# EAGLE design USBISPTiny (EAGLE 6.1)
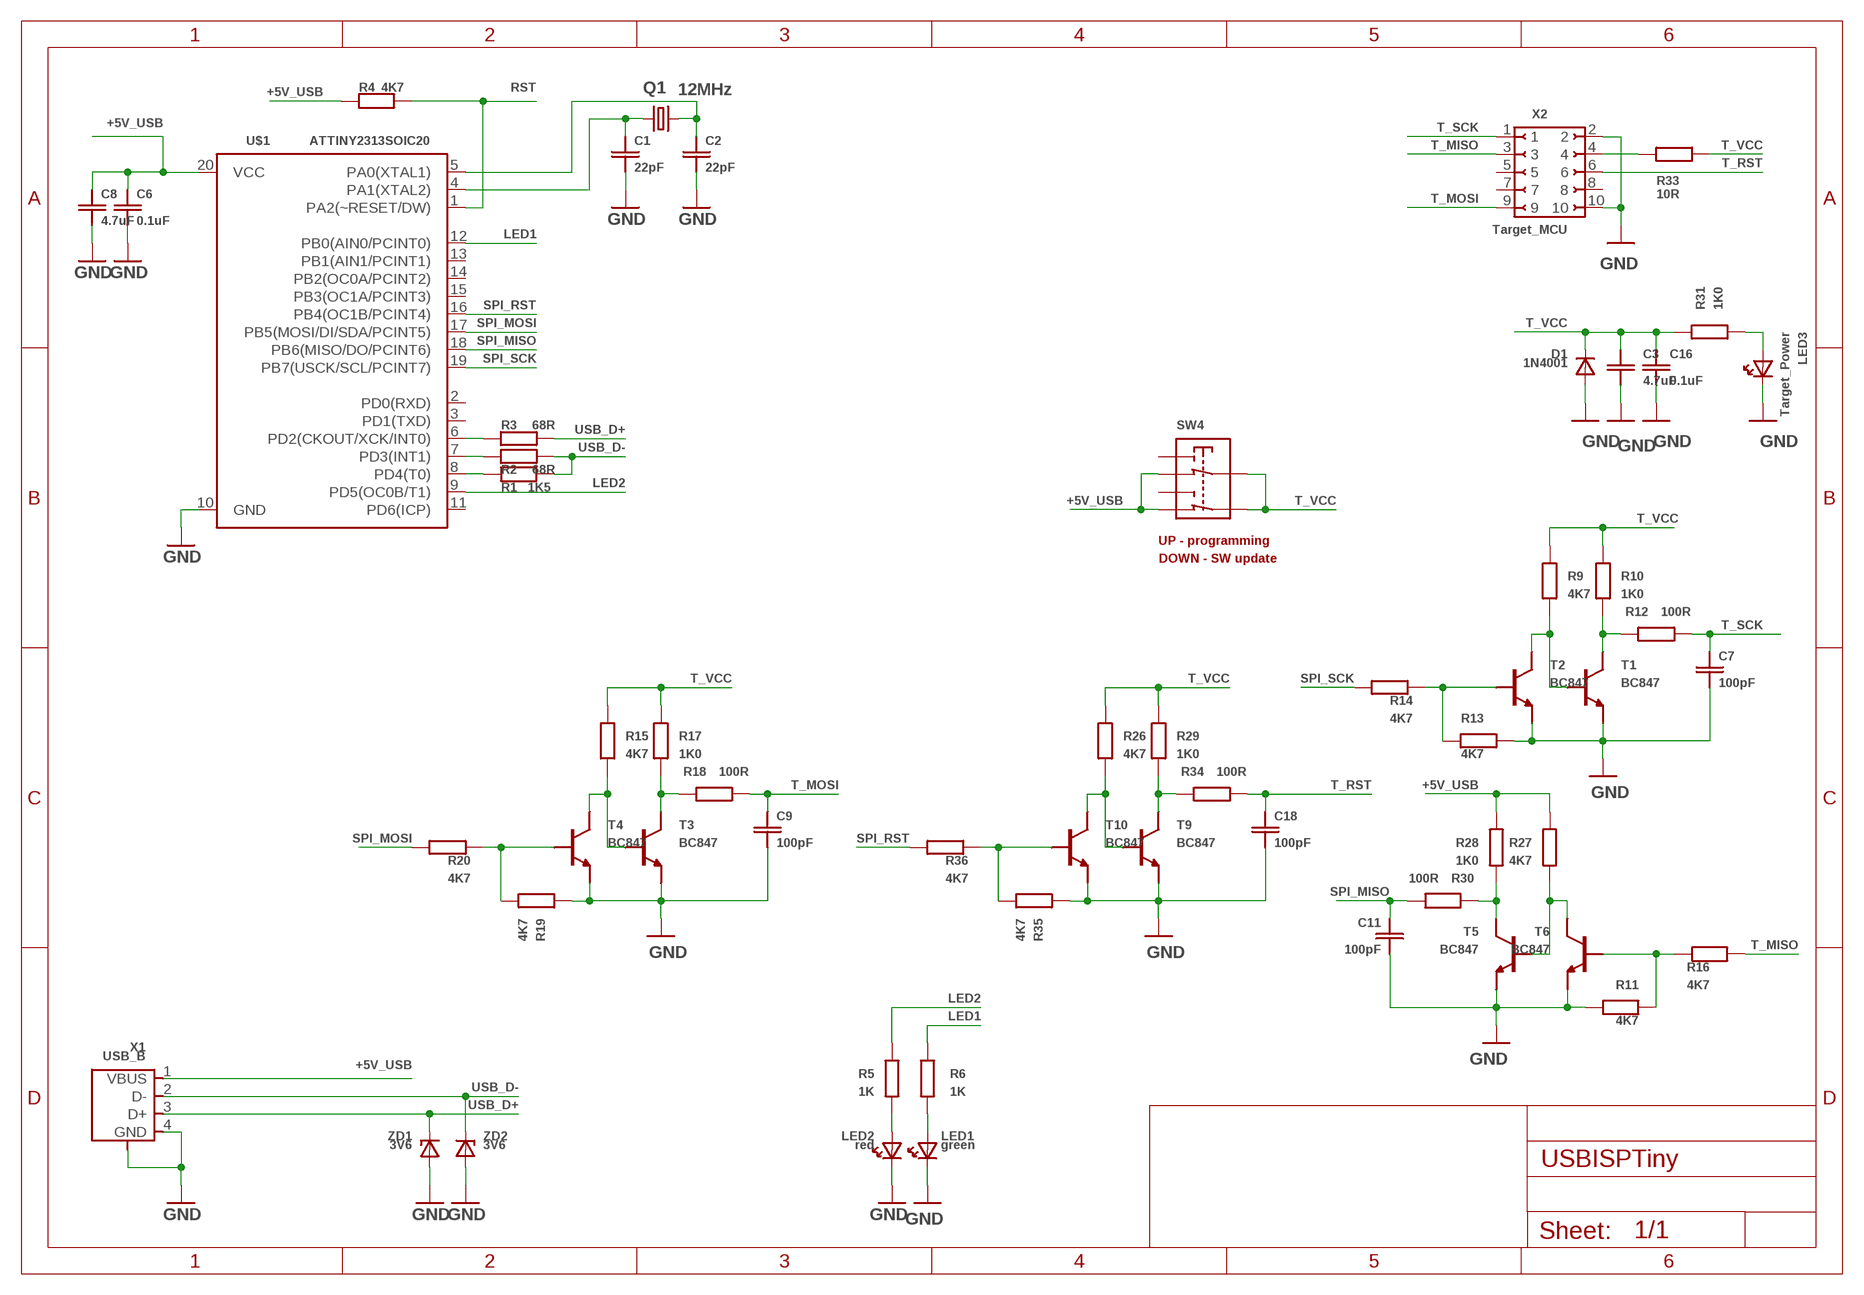
[diagram p0: schematic, sheet 1]

## Parts
C1  22pF  CSMD_0805  [RSMD_0805]
C2  22pF  CSMD_0805  [RSMD_0805]
C3  4.7uF  CSMD_1206  [RSMD_1206]
C6  0.1uF  CSMD_0805  [RSMD_0805]
C7  100pF  CSMD_0805  [RSMD_0805]
C8  4.7uF  CSMD_1206  [RSMD_1206]
C9  100pF  CSMD_0805  [RSMD_0805]
C11  100pF  CSMD_0805  [RSMD_0805]
C16  0.1uF  CSMD_0805  [RSMD_0805]
C18  100pF  CSMD_0805  [RSMD_0805]
D1  1N4001  1N4001DO-41_10MM  [DO-41_10MM]
LED1  green  LED3MM  [LED3MM]
LED2  red  LED3MM  [LED3MM]
LED3  Target_Power  LED3MM  [LED3MM]
Q1  12MHz  CRYSTALHC49U-V  [HC49U-V]
R1  1K5  RSMD_0805  [RSMD_0805]
R2  68R  RSMD_0805  [RSMD_0805]
R3  68R  RSMD_0805  [RSMD_0805]
R4  4K7  RSMD_1206  [RSMD_1206]
R5  1K  RSMD_0805  [RSMD_0805]
R6  1K  RSMD_0805  [RSMD_0805]
R9  4K7  RSMD_0805  [RSMD_0805]
R10  1K0  RSMD_0805  [RSMD_0805]
R11  4K7  RSMD_0805  [RSMD_0805]
R12  100R  R0204  [R0204]
R13  4K7  RSMD_0805  [RSMD_0805]
R14  4K7  RSMD_0805  [RSMD_0805]
R15  4K7  RSMD_0805  [RSMD_0805]
R16  4K7  R0207  [R0207]
R17  1K0  RSMD_0805  [RSMD_0805]
R18  100R  R0204  [R0204]
R19  4K7  RSMD_0805  [RSMD_0805]
R20  4K7  RSMD_0805  [RSMD_0805]
R26  4K7  RSMD_0805  [RSMD_0805]
R27  4K7  RSMD_0805  [RSMD_0805]
R28  1K0  RSMD_0805  [RSMD_0805]
R29  1K0  RSMD_0805  [RSMD_0805]
R30  100R  RSMD_0805  [RSMD_0805]
R31  1K0  RSMD_0805  [RSMD_0805]
R33  10R  R0204  [R0204]
R34  100R  R0207  [R0207]
R35  4K7  RSMD_0805  [RSMD_0805]
R36  4K7  RSMD_0805  [RSMD_0805]
SW4  SWITCH_DOUBLE(2.54X4MM)  [SWITCH_DOUBLE_2.54X4.0MM]
T1  BC847  BC847SOT23_SMALL_PADS  [SOT23_SMALL_PADS]
T2  BC847  BC847SOT23_SMALL_PADS  [SOT23_SMALL_PADS]
T3  BC847  BC847SOT23_SMALL_PADS  [SOT23_SMALL_PADS]
T4  BC847  BC847SOT23_SMALL_PADS  [SOT23_SMALL_PADS]
T5  BC847  BC847SOT23_SMALL_PADS  [SOT23_SMALL_PADS]
T6  BC847  BC847SOT23_SMALL_PADS  [SOT23_SMALL_PADS]
T9  BC847  BC847SOT23_SMALL_PADS  [SOT23_SMALL_PADS]
T10  BC847  BC847SOT23_SMALL_PADS  [SOT23_SMALL_PADS]
U$1  ATTINY2313SOIC20  [SOIC20]
X1  USB_B  USB_TYPE_B(TYPE_B_SMALL_PADS)  [USB_TYPE_B_SMALL_PADS]
X2  Target_MCU  PIN2X5_FEMALE2.54MM_RIGHT_ANGLE_SMALL_PADS  [PIN2X5_2.54MM_FEMALE_RIGHT_ANGLE_SMALL_PADS]
ZD1  3V6  ZENNER(SOD_80)  [SOD-80]
ZD2  3V6  ZENNER(SOD_80)  [SOD-80]

## Nets
+5V_USB: C6.PAD_1(PIN1) C8.PAD_1(PIN1) R4.PAD_0(PIN0) R27.PAD_0(PIN0) R28.PAD_0(PIN0) SW4.POS_B1 SW4.POS_B2 U$1.20(VCC) X1.1(VBUS)
GND: C1.PAD_0(PIN0) C2.PAD_0(PIN0) C3.PAD_0(PIN0) C6.PAD_0(PIN0) C7.PAD_0(PIN0) C8.PAD_0(PIN0) C9.PAD_0(PIN0) C11.PAD_0(PIN0) C16.PAD_0(PIN0) C18.PAD_0(PIN0) D1.ANODE LED1.CATHODE LED2.CATHODE LED3.CATHODE R11.PAD_0(PIN0) R13.PAD_0(PIN0) R19.PAD_0(PIN0) R35.PAD_0(PIN0) T1.2(E) T2.2(E) T3.2(E) T4.2(E) T5.2(E) T6.2(E) T9.2(E) T10.2(E) U$1.10(GND) X1.4(GND) X1.PACKAGE_PAD1(PACKAGE) X1.PACKAGE_PAD2(PACKAGE) X2.2 X2.10 ZD1.ANODE ZD2.ANODE
LED1: R6.PAD_0(PIN0) U$1.12(PB0(AIN0/PCINT0))
LED2: R5.PAD_0(PIN0) U$1.9(PD5(OC0B/T1))
N$1: C2.PAD_1(PIN1) Q1.2 U$1.5(PA0(XTAL1))
N$2: R10.PAD_1(PIN1) R12.PAD_0(PIN0) T1.3(C)
N$3: C1.PAD_1(PIN1) Q1.1 U$1.4(PA1(XTAL2))
N$4: R3.PAD_0(PIN0) U$1.6(PD2(CKOUT/XCK/INT0))
N$5: R2.PAD_1(PIN1) U$1.7(PD3(INT1))
N$6: R1.PAD_1(PIN1) U$1.8(PD4(T0))
N$7: LED2.ANODE R5.PAD_1(PIN1)
N$8: LED1.ANODE R6.PAD_1(PIN1)
N$9: R9.PAD_1(PIN1) T1.1(B) T2.3(C)
N$11: R13.PAD_1(PIN1) R14.PAD_0(PIN0) T2.1(B)
N$12: LED3.ANODE R31.PAD_1(PIN1)
N$20: R17.PAD_1(PIN1) R18.PAD_0(PIN0) T3.3(C)
N$22: R15.PAD_1(PIN1) T3.1(B) T4.3(C)
N$23: R11.PAD_1(PIN1) R16.PAD_0(PIN0) T6.1(B)
N$24: R19.PAD_1(PIN1) R20.PAD_0(PIN0) T4.1(B)
N$25: R33.PAD1(PIN1) X2.4
N$33: R28.PAD_1(PIN1) R30.PAD_0(PIN0) T5.3(C)
N$35: R27.PAD_1(PIN1) T5.1(B) T6.3(C)
N$39: R29.PAD_1(PIN1) R34.PAD_0(PIN0) T9.3(C)
N$40: R26.PAD_1(PIN1) T9.1(B) T10.3(C)
N$41: R35.PAD_1(PIN1) R36.PAD_0(PIN0) T10.1(B)
RST: R4.PAD_1(PIN1) U$1.1(PA2(~RESET/DW))
SPI_MISO: C11.PAD_1(PIN1) R30.PAD_1(PIN1) U$1.18(PB6(MISO/DO/PCINT6))
SPI_MOSI: R20.PAD_1(PIN1) U$1.17(PB5(MOSI/DI/SDA/PCINT5))
SPI_RST: R36.PAD_1(PIN1) U$1.16(PB4(OC1B/PCINT4))
SPI_SCK: R14.PAD_1(PIN1) U$1.19(PB7(USCK/SCL/PCINT7))
T_MISO: R16.PAD1(PIN1) X2.3
T_MOSI: C9.PAD_1(PIN1) R18.PAD1(PIN1) X2.9
T_RST: C18.PAD_1(PIN1) R34.PAD1(PIN1) X2.6
T_SCK: C7.PAD_1(PIN1) R12.PAD1(PIN1) X2.1
T_VCC: C3.PAD_1(PIN1) C16.PAD_1(PIN1) D1.CATHODE R9.PAD_0(PIN0) R10.PAD_0(PIN0) R15.PAD_0(PIN0) R17.PAD_0(PIN0) R26.PAD_0(PIN0) R29.PAD_0(PIN0) R31.PAD_0(PIN0) R33.PAD_0(PIN0) SW4.CENTER1 SW4.CENTER2
USB_D+: R3.PAD_1(PIN1) X1.3(D+) ZD1.CATHODE
USB_D-: R1.PAD_0(PIN0) R2.PAD_0(PIN0) X1.2(D-) ZD2.CATHODE
Unconnected: SW4.POS_A1 SW4.POS_A2 U$1.2(PD0(RXD)) U$1.3(PD1(TXD)) U$1.11(PD6(ICP)) U$1.13(PB1(AIN1/PCINT1)) U$1.14(PB2(OC0A/PCINT2)) U$1.15(PB3(OC1A/PCINT3)) X2.5 X2.7 X2.8

## Notes on the sheet
- UP - programming
- DOWN - SW update

## Library data of the parts
C1-C3 C6-C9 C11 C16 C18 = __MyCommonLib1:C
D1 = __MyCommonLib1:1N4001
LED1-LED3 = __MyCommonLib1:LED3MM
Q1 = crystal:CRYSTAL: CRYSTAL; OC_FARNELL: 1666969; OC_NEWARK: unknown
R1-R6 R9-R20 R26-R31 R33-R36 = __MyCommonLib1:R
SW4 = __MyCommonLib1:SWITCH_DOUBLE
T1-T6 T9 T10 = __MyCommonLib1:BC847
U$1 = __MyCommonLib1:ATTINY2313
X1 = __MyCommonLib1:USB_TYPE_B
X2 = __MyCommonLib1:PIN2X5_FEMALE
ZD1 ZD2 = __MyCommonLib1:ZENNER

## Board
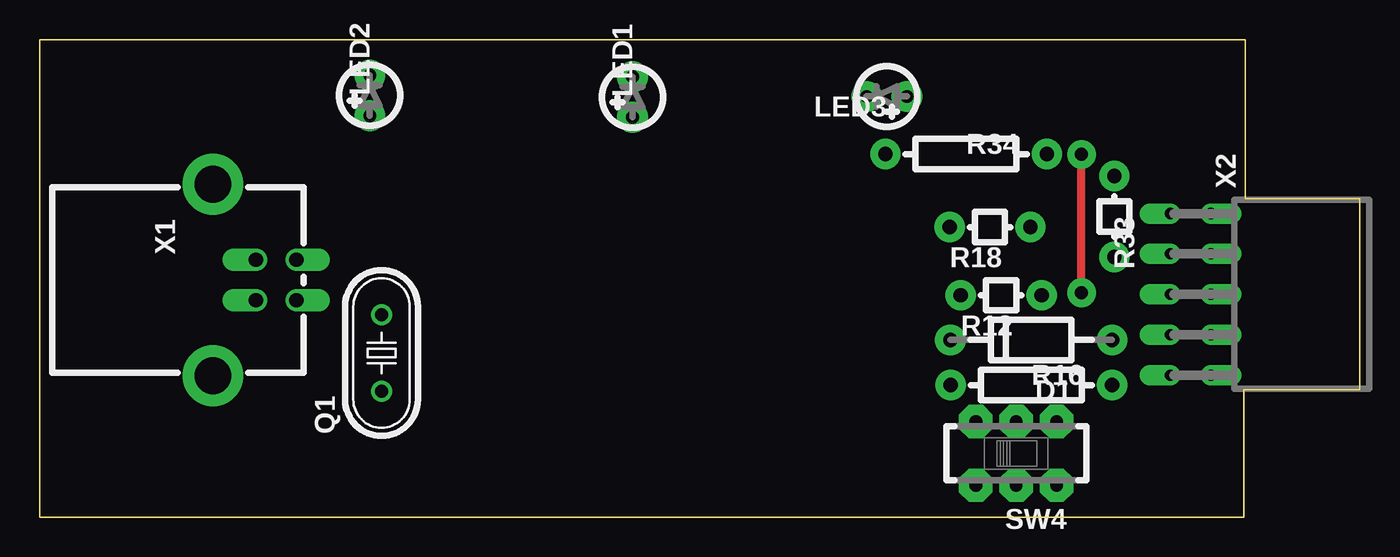
[diagram p1: board, top side]
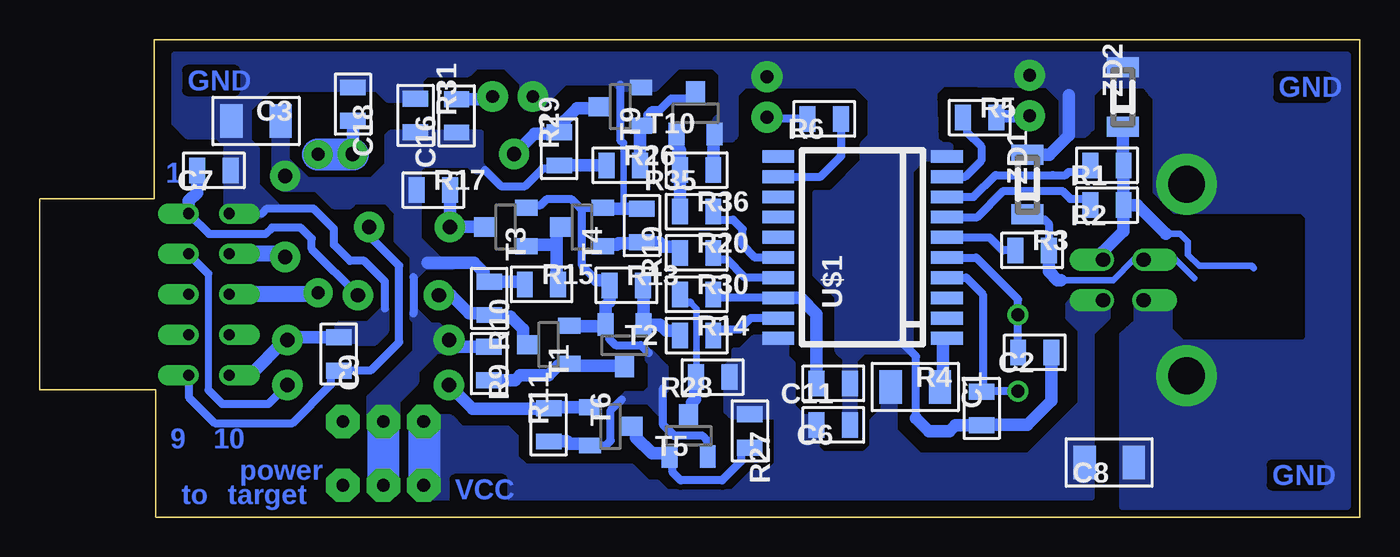
[diagram p2: board, bottom side, seen from below]

Size 83 x 30 mm. Coordinates in mm from the lower left corner, seen from the top.
Outline: 0,0 0,30 75.8,30 75.8,20 83,20 83,8 75.7,8 75.7,0 0,0
Copper layers (1*16): Top 0.035mm / dielectric 1.5mm / Bottom 0.035mm
Design rules: minimum track width 0.35mm, minimum drill 0.6mm, track to track 0.35mm, track to pad 0.35mm, pad to pad 0.25mm, via to via 0.35mm, smd to smd 8mil, copper to edge 0.2mm, drill to drill 8mil, minimum pad ring 10mil, minimum via ring 8mil, stop-mask expansion 4mil, vias tented up to drill 0mil, thermal gap 10mil

### Footprints (pad centres in the part's own frame; a part is rotated, then mirrored left to right if it is on the bottom)
RSMD_0805 = smd 1 x 1.6: PAD_0 -1.05,0; PAD_1 1.05,0
RSMD_1206 = smd 1.4 x 2.1: PAD_0 -1.55,0; PAD_1 1.55,0
DO-41_10MM = drill 0.9 pad 1.93: ANODE -5.08,0; CATHODE 5.08,0
LED3MM = drill 0.8 pad 1.93: ANODE -1.27,0; CATHODE 1.27,0
HC49U-V = drill 0.813: 1 -2.413,0; 2 2.413,0
R0204 = drill 0.9 pad 1.9: PAD1 2.54,0; PAD_0 -2.54,0
R0207 = drill 0.9 pad 1.9: PAD1 5.08,0; PAD_0 -5.08,0
SWITCH_DOUBLE_2.54X4.0MM = drill 0.8 pad 2.1 octagon: CENTER1 0,-2; CENTER2 0,2; POS_A1 -2.54,-2; POS_A2 -2.54,2; POS_B1 2.54,-2; POS_B2 2.54,2
SOT23_SMALL_PADS = smd 1 x 1.4: 1 1.2,1.3; 2 -1.2,1.3 | smd 1.2 x 1.4: 3 0,-1.3
SOIC20 = smd 0.8 x 2: 1 -5.715,-5.3; 2 -4.445,-5.3; 3 -3.175,-5.3; 4 -1.905,-5.3; 5 -0.635,-5.3; 6 0.635,-5.3; 7 1.905,-5.3; 8 3.175,-5.3; 9 4.445,-5.3; 10 5.715,-5.3; 11 5.715,5.3; 12 4.445,5.3; 13 3.175,5.3; 14 1.905,5.3; 15 0.635,5.3; 16 -0.635,5.3; 17 -1.905,5.3; 18 -3.175,5.3; 19 -4.445,5.3; 20 -5.715,5.3
USB_TYPE_B_SMALL_PADS = drill 0.9 pad 1.4 offset: 1 1.27,2.54; 2 -1.27,2.54; 3 -1.27,0; 4 1.27,0 | drill 2.3 pad 3.81: PACKAGE_PAD1 -6.02,-2.71; PACKAGE_PAD2 6.02,-2.71
PIN2X5_2.54MM_FEMALE_RIGHT_ANGLE_SMALL_PADS = drill 0.7 pad 1.3 offset: 1 5.08,1.27; 2 5.08,3.81; 3 2.54,1.27; 4 2.54,3.81; 5 0,1.27; 6 0,3.81; 7 -2.54,1.27; 8 -2.54,3.81; 9 -5.08,1.27; 10 -5.08,3.81
SOD-80 = smd 1.25 x 2: ANODE 1.875,0; CATHODE -1.875,0

### Placement (x,y rotation side)
C1  23.76,6.83 90 bottom
C2  20.43,10.35 180 bottom
C3  69.4,24.9 0 bottom
C6  33.1,5.8 180 bottom
C7  72.05,21.79 180 bottom
C8  15.76,3.42 180 bottom
C9  64.19,10.25 270 bottom
C11  33.1,8.4 180 bottom
C16  59.38,25.25 270 bottom
C18  63.31,25.95 270 bottom
D1  62.34,11.13 180 top
LED1  37.27,26.4 90 top
LED2  20.75,26.5 90 top
LED3  53.26,26.43 180 top
Q1  21.49,10.31 90 top
R1  15.9,22.1 180 bottom
R2  15.9,19.6 180 bottom
R3  20.6,16.77 0 bottom
R4  27.94,8.17 0 bottom
R5  23.9,25.1 0 bottom
R6  33.67,25.03 180 bottom
R9  54.76,9.65 270 bottom
R10  54.74,13.75 270 bottom
R11  51,5.8 90 bottom
R12  60.45,13.94 0 top
R13  46.12,14.56 0 bottom
R14  41.7,11.4 0 bottom
R15  51.45,14.63 0 bottom
R16  62.35,8.29 0 top
R17  58.25,20.55 0 bottom
R18  59.75,18.23 0 top
R19  45.15,18.32 270 bottom
R20  41.7,16.6 0 bottom
R26  46.3,22.1 0 bottom
R27  38.35,5.41 270 bottom
R28  40.69,8.79 180 bottom
R29  50.34,23.15 90 bottom
R30  41.7,14 0 bottom
R31  56.79,25.22 90 bottom
R33  67.57,18.89 270 top
R34  58.25,22.82 0 top
R35  41.7,21.8 180 bottom
R36  41.7,19.2 0 bottom
SW4  61.4,4 180 top
T1  51,10.83 270 bottom
T2  46.23,10.8 0 bottom
T3  53.7,18.23 270 bottom
T4  48.9,18.23 270 bottom
T5  42.2,5.1 180 bottom
T6  47.1,5.7 90 bottom
T9  46.5,25.8 270 bottom
T10  41.77,25.38 180 bottom
U$1  31.27,16.95 90 bottom
X1  13.6,14.9 270 top
X2  74.9,14 90 top
ZD1  20.9,20.9 90 bottom
ZD2  14.9,26.4 90 bottom

### Tracks (layer width: path | path; a pad name or v marks a point on that pad's centre or on a via)
+5V_USB
  Bottom 0.5: R27.PAD_0 38.31,6.5
  Bottom 2: SW4.POS_B1 58.8,5.94 58.8,2.06 SW4.POS_B2
  pour Bottom (no thermals): 58.9,1.3 16.9,1.3 16.9,11.6 15.9,12.6 15.9,13.9 16,14 17.6,14 18.3,13.3 18.3,12.6 17.5,11.8 17.5,7.1 20.8,3.8 27.7,3.8 29.3,5.4 29.3,8.3 29.9,8.3 29.9,6.7 30.6,6 30.6,4.4 31.1,3.9 33.8,3.9 34.2,4.3 34.2,6.2 35,6.2 35.7,6.9 35.7,9.6 36.1,10 36.1,11.2 38.1,11.2 38.9,10.4 39.3,10.4 39.3,9.9 39.8,9.4 39.8,6.7 39.5,6.4 36.8,6.4 36.6,6.2 36.6,3.3 37.2,2.7 38.2,2.7 39.4,1.5 43.6,1.5 44.2,2.1 44.8,2.1 45.8,3.1 52.5,3.1 53.1,3.7 53.1,5 53.6,5.5 56.5,5.5 57.2,6.2 59,6.2
GND
  Bottom 0.4: 46.3,23.5 46.3,19.37
  Bottom 0.5: 27.9,6.2 27.9,10.1 28.8,11 | T3.2 52.24,19.6 51.5,19.6 51.1,20 49.6,20 49.03,19.43 48.9,19.43 | 48.9,19.43 T4.2 47.53,19.37 | 46.5,27.2 46.5,23.7 46.3,23.5 | 61.3,13.1 61.3,14.8 62.6,16.1 63.5,16.1 64.5,17.1 64.5,18.1 65.8,19.4 68.7,19.4 69.03,19.07 | T6.2 47.4,4.5 47.1,4.8 47.1,6.7 46.4,7.4 | T5.2 41,4.8 41.3,5.1 43.1,5.1 43.8,5.8 43.8,8.1 | 48,14.9 48.9,15.8 48.9,19.43 | 47.53,12 47.2,11.67 47.2,11.2 46.8,10.8 45.2,10.8 44.7,10.3 | 20.43,22.77 ZD1.ANODE 20.88,22.8 19.7,22.8
  Bottom 0.8: D1.ANODE 67.25,11.3 C9.PAD_0 | T6.2 48.5,4.6 49.7,4.6 49.85,4.75 R11.PAD_0 | T1.2 49.66,12 47.53,12 T2.2 47.43,13.27 47.17,13.53 R13.PAD_0 47.51,14.9 48,14.9 | R19.PAD_0 46.3,19.37 47.07,19.37 47.13,19.43 T4.2 | R35.PAD_0 40.65,24 T10.2 | 67.47,11.13 67.56,11.13 69.78,8.92 X2.10 | C2.PAD_0 19.38,7.32 20.9,5.8 23.74,5.8 C1.PAD_0 25.42,5.78 25.8,5.4 27.1,5.4 27.9,6.2 | ZD1.ANODE 19.52,22.77 18.3,24 18.3,26.5
  Bottom 1: D1.ANODE 67.47,11.13
  pour Bottom (no thermals): 61.3,13.1 61.3,11.7 62,11 62.9,11 63,11.1 64.1,11.1 64.2,11.2 64.2,12 64.1,12.1 62.3,12.1
  pour Bottom (no thermals): 74.5,29 74.5,24.8 73.7,24 71.8,24 71.2,23.4 71.2,19 69.2,19 68.8,19.4 68,19.4 69.4,20.8 69.4,23.1 69.9,23.6 69.9,25.7 68.6,27 61.8,27 61.1,26.3 59.1,26.3 59.1,27.5 58.7,27.9 56.1,27.9 55.6,28.4 53.7,28.4 52.6,27.3 52.6,26 52.4,25.8 51.6,25.8 50,27.4 46.9,27.4 46.5,27 44.3,27 42.9,28.4 40.6,28.4 40.1,27.9 40.1,25.3 40.5,24.9 40.5,23.8 39.5,23.8 39.3,24 39.3,26.6 38.7,27.2 31.6,27.2 30.7,26.3 30.7,23.9 31.2,23.4 31.2,22.3 33.2,20.3 34.2,20.3 34.2,15.3 32.8,13.9 32.8,10.5 32.3,10 32.3,5.6 31.8,5.6 31.8,9.9 31.2,10.5 28.3,10.5 28.3,21.8 27.5,22.6 25.8,22.6 25.8,23.3 26.3,23.3 26.7,23.7 26.8,26.7 26.2,27.3 19.6,27.2 18.7,26.3 18.7,24.1 17.3,24.1 16.9,24.5 16.9,26.6 16.3,27.2 13.5,27.2 13.1,26.7 12.8,26.4 12.8,20.5 11.6,19.3 3.6,19.3 3.2,18.9 3.2,11.2 3.5,10.9 11.2,10.9 12,11.7 12,13.7 14,13.7 14,12.2 14.9,11.4 14.9,0.7 0.8,0.7 0.8,29
  pour Bottom (no thermals): 43.7,9.4 43.7,8 43.9,7.8 43.9,6.5 44.7,7.3 46.5,7.3 46.1,7.7 44.9,7.7 44.5,8.1 44.5,9.7 44.7,9.9 44.7,10.4
LED1
  Bottom 0.5: U$1.12 33.91,21.39 32.6,22.7 32.62,22.72 R6.PAD_0
LED2
  Bottom 0.5: R5.PAD_0 24.7,25.1 24.7,24.2 23.8,23.3 23.8,22.4 24.81,21.39 U$1.9
N$1
  Bottom 0.5: U$1.5 24.11,16.31 21.49,13.69 Q1.2 C2.PAD_1
N$2
  Bottom 0.8: T1.3 52.6,11.13 52.6,11.8 53.4,12.6 54.64,12.6 R10.PAD_1 54.84,12.8 56,12.8 57.14,13.94 R12.PAD_0
N$3
  Bottom 0.5: U$1.4 24.74,15.04 23.7,14 23.7,7.94 C1.PAD_1 23.75,7.9 Q1.1
N$4
  Bottom 0.5: U$1.6 23.28,17.58 22.46,16.77 R3.PAD_0
N$5
  Bottom 0.5: U$1.7 24.05,18.85 22.4,20.5 18.7,20.5 18.2,20 17.35,20 R2.PAD_1
N$6
  Bottom 0.5: U$1.8 24.28,20.12 22.9,21.5 19.3,21.5 18.5,21.5 18.3,21.7 17.9,21.7 17.35,21.7 R1.PAD_1
N$7
  Bottom 0.8: LED2.ANODE arc90 20.78,25.2 22.75,25.2 arc-90 R5.PAD_1
N$8
  Bottom 0.5: R6.PAD_1 37.17,25.03 LED1.ANODE
N$9
  Bottom 0.8: T2.3 49.56,9.5 T1.1 49.83,9.5 50.4,9.5 51,8.9 52.8,8.9 53.1,8.6 R9.PAD_1
N$11
  Bottom 0.8: R14.PAD_0 43.05,11.7 43.6,11.7 44,12.1 T2.1 45.03,14.56 R13.PAD_1
N$12
  Bottom 0.8: R31.PAD_1 54.83,26.27 54.66,26.43 LED3.ANODE
N$20
  Bottom 0.8: T3.3 R18.PAD_0 R17.PAD_1
N$22
  Bottom 0.8: T4.3 50.5,17.93 50.5,17.1 | 50.5,17.1 50.5,14.73 R15.PAD_1 | T3.1 52.34,17.1 50.5,17.1
N$23
  Bottom 0.8: T6.1 50.95,6.9 R11.PAD_1 51.05,6.8 55.77,6.8 R16.PAD_0
N$24
  Bottom 0.8: R20.PAD_0 42.75,17 43.8,17 44.07,17.27 R19.PAD_1 45.15,17.2 46.6,17.2 46.7,17.1 47.53,17.1 T4.1
N$25
  Bottom 1: R33.PAD1 67.76,16.54 X2.4
N$33
  Bottom 0.4: 41.7,8.83 41.7,13.1 42.1,13.5
  Bottom 0.5: R28.PAD_1 41.7,8.83 | R30.PAD_0 42.75,13.5 42.1,13.5
  Bottom 0.8: T5.3 42,6.6 42,7.2 41.8,7.4 41.8,8.73 R28.PAD_1
N$35
  Bottom 0.5: R27.PAD_1 38.9,4.36 38.9,3.5 40.1,2.3 42.7,2.3 43.2,2.8 43.2,3.6 T5.1
  Bottom 0.8: T5.1 43.6,4 44.5,4 45.5,5 45.5,5.4 T6.3
N$39
  Bottom 0.8: R34.PAD_0 51.88,24.1 50.44,24.1 R29.PAD_1 50,24.54 50,24.9 49.2,25.7 47.9,25.7 T9.3
N$40
  Bottom 0.5: T9.1 45,24.6 44.8,24.8 44.8,25.3 44.5,25.6 44,25.6 43.3,26.3 42.15,26.3 T10.3
  Bottom 0.8: R26.PAD_1 45.25,24.55 T9.1
N$41
  Bottom 0.8: T10.1 42.9,24.02 42.9,23.2 42.75,23.05 R35.PAD_1 R36.PAD_0
RST
  Bottom 0.8: U$1.1 26.2,11 26.2,8.36 R4.PAD_1
SPI_MISO
  Bottom 0.5: U$1.18 40.65,13.77 R30.PAD_1
  Bottom 0.8: U$1.18 35.17,13.77 34.15,12.75 C11.PAD_1
SPI_MOSI
  Bottom 0.5: U$1.17 38.64,15.04 39.8,16.2 40.65,16.2 R20.PAD_1
SPI_RST
  Bottom 0.5: U$1.16 38.01,16.31 38.8,17.1 38.8,18.1 39.4,18.7 40.65,18.7 R36.PAD_1
SPI_SCK
  Bottom 0.5: U$1.19 38.3,12.5 39,11.8 40.25,11.8 R14.PAD_1
T_MISO
  Bottom 0.45: 72.4,15.3 72.4,8
  Bottom 0.5: 72.4,8 71.5,7.1 68.62,7.1 R16.PAD1 | X2.3 72.4,15.3
T_MOSI
  Bottom 0.5: C9.PAD_1 arc-90 64.7,8.7 64.7,8.3 67.1,5.9 72,5.9 73.63,7.53 X2.9 | C9.PAD_1 | R18.PAD1 62.29,17.69 60.4,15.8 60.4,11 62.2,9.2 64.1,9.2 C9.PAD_1
T_RST  (via drill 0.8 pad 1.8)
  Top 0.5: v65.5,14.1 v65.5,22.8
  Bottom 0.8: C18.PAD_1 63.31,22.84 R34.PAD1 63.38,22.82 63.4,22.8
  Bottom 1: v65.5,14.1 65.6,14 X2.6
  Bottom 2: v65.5,22.8 63.4,22.8 63.3,22.8
T_SCK
  Bottom 0.5: R12.PAD1 65.9,16.85 65.9,17.5 66.6,18.2 68.4,18.2 68.8,17.8 72.35,17.8 X2.1
  Bottom 0.8: C7.PAD_1 73.1,20.4 73.63,19.87 X2.1
T_VCC
  Bottom 0.5: 55,21.8 54,20.8 52.5,20.8 51.4,21.9 50.6,21.9 50.4,22.1 | 59.5,15.1 59.5,12.8
  Bottom 0.8: D1.CATHODE 57.23,11.13 56.8,10.7 R9.PAD_0 | R15.PAD_0 52.67,14.8 R10.PAD_0 55.1,14.8 55.1,15.4 55.7,16 58.6,16 | R26.PAD_0 R29.PAD_0 50.4,22.1
  Bottom 2: SW4.CENTER1 SW4.CENTER2
  pour Bottom (no thermals): 57.7,10.5 58.1,10.5 59.4,9.2 59.4,8.5 60.6,7.3 60.6,6.5 62.2,6.5 62.2,7.5 59.3,10.4 59.3,12.3 59.5,12.5 59.5,12.9 59.4,12.9 58.5,12 58,12 57.2,11.2
  pour Bottom (no thermals): 59.5,15.1 58.8,15.8 57,15.8 57.3,16.1 57.9,16.1 59.2,17.4 59.2,21.9 58.9,22.2 56,22.2 55.6,21.8 55,21.8 55.3,22.1 55.3,24.1 60.9,24.1 61.1,23.9 61.1,22.1 62.1,21.1 66.2,21.1 67.5,22.4 67.5,25.2 68.2,25.2 68.2,21.2 67.7,20.7 65.6,20.7 64.5,19.6 63.5,19.6 63.2,19.9 61.2,19.9 60.5,19.2 60.5,17.4 59.5,16.4
USB_D+
  Bottom 0.4: 18.8,14.9 15.5,14.9 14.23,16.17 X1.3 11.57,16.17 10.4,15
  Bottom 0.5: ZD1.CATHODE 20.57,18.7 19.8,18.7 19.55,18.45 R3.PAD_1
  Bottom 0.8: 18.8,14.9 19,14.9 19.55,15.45 R3.PAD_1
USB_D-
  Bottom 0.4: 12.2,17.8 11.3,17.8 10.8,17.3 10.8,16.5 10.1,15.8 6.8,15.8 6.65,15.65
  Bottom 0.8: R2.PAD_0 R1.PAD_0 14.9,22.15 ZD2.CATHODE | 12.2,17.8 14,19.6 R2.PAD_0 | X1.2 16.14,16.66 14.85,17.95 R2.PAD_0

### Text on the board
Bottom: GND | GND | 1 | power | 10 | 9 | GND | VCC | target | to